# Altium project IMU Gyro+Acc only.PrjPcb
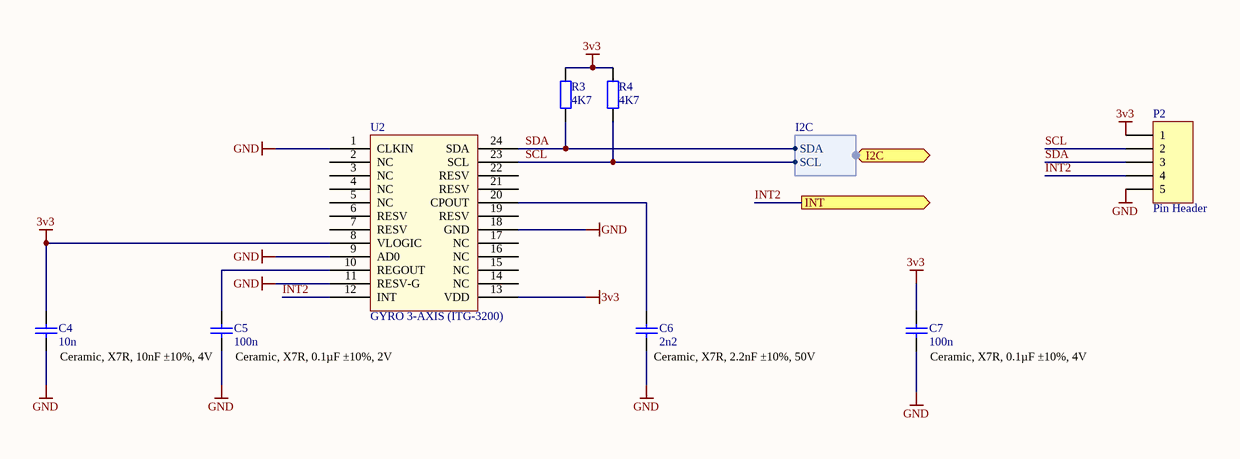
[diagram p0: GYRO 3-AXIS - ITG-3200.SchDoc]
3 sheets, 16 parts. Net scope: hierarchical (ports join the sheet entries above them; power ports are global).
Board file: Gyro+Accelero.PcbDoc
Sheets:
  GYRO 3-AXIS - ITG-3200.SchDoc
  Accelerometer 3-AXIS - BMA180.SchDoc
  Regulator 3v3-250mA MCP1702.SchDoc

## Sheet GYRO 3-AXIS - ITG-3200.SchDoc: Gyroscope, 3-Axis - I2C
size A4; Organization: Altium Limited; Address1: 3 Minna Close; Address2: Belrose; Address3: NSW 2085; Address4: Australia

### Parts
C4  10n  [C0805]
C5  100n  [C0805]
C6  2n2  [C0805]
C7  100n  [C0805]
P2  Pin Header  [PH1x5_2.54]
R3  value 4K7  [R0805]  (hidden comment: RESISTOR)
R4  value 4K7  [R0805]  (hidden comment: RESISTOR)
U2  GYRO 3-AXIS (ITG-3200)  [QFN50P400X400-24V2M - GYRO 3axis]

### Ports
I2C (harness I2C), INT (out)

### Harnesses
I2C: SDA, SCL

### Nets
3v3: C4.2 C7.2 P2.1 R3.1 R4.1 U2.8(VLOGIC) U2.13(VDD)
GND: C4.1 C5.1 C6.1 C7.1 P2.5 U2.1(CLKIN) U2.9(AD0) U2.11(RESV-G) U2.18(GND)
INT2: P2.4 U2.12(INT) ; port INT
SCL: P2.2 R4.2 U2.23(SCL) ; port I2C.SCL
SDA: P2.3 R3.2 U2.24(SDA) ; port I2C.SDA
NetC5_2: C5.2 U2.10(REGOUT)
NetC6_2: C6.2 U2.20(CPOUT)

Not connected (* = marked no-connect by the designer): U2 2(NC) 3(NC) 4(NC) 5(NC) 6(RESV) 7(RESV) 14(NC) 15(NC) 16(NC) 17(NC) 19(RESV) 21(RESV) 22(RESV)

### Notes on the sheet
- Ceramic, X7R, 10nF ±10%, 4V
- (near C5) Ceramic, X7R, 0.1µF ±10%, 2V
- (near C6) Ceramic, X7R, 2.2nF ±10%, 50V
- (near C7) Ceramic, X7R, 0.1µF ±10%, 4V
- Disclaimer
  Any design and information, hardware or software  is provided on an "as-is" basis without warranty of any kind and any express or implied warranties, including, but not limited to, the implied warranties of merchantability and fitness for a particular purpose are disclaimed. In no event shall wnpd (or KeaDrone)be liable for any direct, indirect, incidental, special, exemplary, or consequential damages (including, but not limited to, procurement of substitute goods or services; loss of use, data, or profits; or business interruption) however caused and on any theory of liability, whether in contract, strict liability, or tort (including negligence or otherwise) arising in any way out of the use of this firmware, hardware, software or information, even if wnpd (or KeaDrone) has been advised by user of the possibility of such potential loss or damage. The user agrees to hold wnpd (or KeaDrone) harmless from and against any and all claims, losses, liabilities and expenses.
- Title
- Size:
- Date:
- A4
- Name:
- Time:
- Ing. W. Pietersz
- Revision:
- Sheet
- of
- WillyPietersz@gmail.com
- Contact:
- -
- www.wnpd.nl
- File:

### Library data of the parts
C4 = 10n: Tolerance: 0.1; LatestRevision Note: Initial Release; Part Number: 10n; Value: 10n; Package: 0805; Component Type: Standard; LatestRevision Date: 31-7-2010; Author: Willy Pietersz; ComponentLink1Description: Manufacturer; ComponentLink2Description: Datasheet
C5 C7 = 100n: Tolerance: 0.1; LatestRevision Note: Initial Release; Part Number: 100n; Value: 100n; Package: 0805; Component Type: Standard; LatestRevision Date: 31-7-2010; Author: Willy Pietersz; Supplier 2: Farnell; Supplier Part Number 2: 1759266; ComponentLink1Description: Manufacturer; ComponentLink2Description: Datasheet
C6 = 2n2: Tolerance: 0.1; LatestRevision Note: Initial Release; Part Number: 2n2; Value: 2n2; Package: 0805; Component Type: Standard; LatestRevision Date: 31-7-2010; Author: Willy Pietersz; ComponentLink1Description: Manufacturer; ComponentLink2Description: Datasheet
P2 = PH1x5: Con1x5; Part Number: PH1x5; Pitch: 2.54; LatestRevision Note: Initial Release; Type: Pin Header; Number Of Pins: 5; Component Type: Standard; LatestRevision Date: 23-11-2010; Author: Willy Pietersz; Supplier 2: Farnell
R3 R4 = 4K7: Manufacturer 1: Panasonic; Manufacturer 1 Part No: ERJT06J472V; Power: 0.25W; Tolerance: 0.05; LatestRevision Note: Initial Release; Published: 8-Jun-2000; LatestRevisionDate: 17-Jul-2002; LatestRevisionNote: Re-released for DXP Platform.; PackageReference: AXIAL-0.4; Publisher: Altium Limited; Part Number: 4K7; Type: Film; Package: 0805; Component Type: Standard; LatestRevision Date: 30-7-2010; Author: Willy Pietersz; ROHS: Y; Supplier 2: Farnell; Supplier Part Number 2: 1577368; ComponentLink1Description: Manufacturer; ComponentLink2Description: Datasheet
U2 = ITG-3200: Gyro, 3-axis; Part Number: ITG-3200; Component Type: Sensor; Supplier 1: Sparkfun; Supplier Part Number 1: ITG-3200; ComponentLink1Description: Datasheet; ComponentLink1URL: http://www.sparkfun.com/datasheets/Sensors/Gyro/PS-ITG-3200-00-01.4.pdf

## Sheet Accelerometer 3-AXIS - BMA180.SchDoc: Accelerometer, 3-Axis - SPI
size A4; Organization: Altium Limited; Address1: 3 Minna Close; Address2: Belrose; Address3: NSW 2085; Address4: Australia
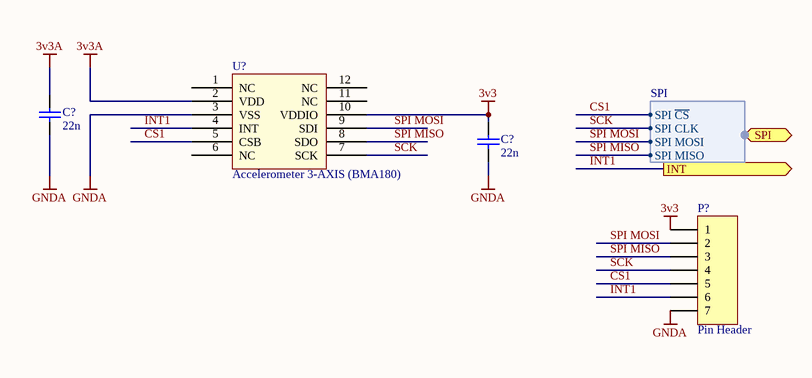
[diagram p1: Accelerometer 3-AXIS - BMA180.SchDoc]

### Parts
C12  22n  [C0805]
C15  22n  [C0805]
P?  Pin Header  [PH1x7_2.54]
U4  Accelerometer 3-AXIS (BMA180)  [BMA180]

### Ports
INT (out), SPI (harness SPI)

### Harnesses
SPI: SPI ~{CS}, SPI CLK, SPI MOSI, SPI MISO

### Nets
3v3: C12.2 P?.1 U4.10(VDDIO)
3v3A: C15.2 U4.2(VDD)
GNDA: C12.1 C15.1 P?.7 U4.3(VSS)
CS1: P?.5 U4.5(CSB) ; port SPI.SPI ~{CS}
INT1: P?.6 U4.4(INT) ; port INT
SCK: P?.4 U4.7(SCK) ; port SPI.SPI CLK
SPI MISO: P?.3 U4.8(SDO) ; port SPI.SPI MISO
SPI MOSI: P?.2 U4.9(SDI) ; port SPI.SPI MOSI

Not connected (* = marked no-connect by the designer): U4 1(NC) 6(NC) 11(NC) 12(NC)

### Notes on the sheet
- Disclaimer
  Any design and information, hardware or software  is provided on an "as-is" basis without warranty of any kind and any express or implied warranties, including, but not limited to, the implied warranties of merchantability and fitness for a particular purpose are disclaimed. In no event shall wnpd (or KeaDrone)be liable for any direct, indirect, incidental, special, exemplary, or consequential damages (including, but not limited to, procurement of substitute goods or services; loss of use, data, or profits; or business interruption) however caused and on any theory of liability, whether in contract, strict liability, or tort (including negligence or otherwise) arising in any way out of the use of this firmware, hardware, software or information, even if wnpd (or KeaDrone) has been advised by user of the possibility of such potential loss or damage. The user agrees to hold wnpd (or KeaDrone) harmless from and against any and all claims, losses, liabilities and expenses.
- Title
- Size:
- Date:
- A4
- Name:
- Time:
- Ing. W. Pietersz
- Revision:
- Sheet
- of
- WillyPietersz@gmail.com
- Contact:
- -
- www.wnpd.nl
- File:

### Library data of the parts
C12 C15 = 22n: Tolerance: 0.1; LatestRevision Note: Initial Release; Part Number: 22n; Value: 22n; Package: 0805; Component Type: Standard; LatestRevision Date: 31-7-2010; Author: Willy Pietersz; ComponentLink1Description: Manufacturer; ComponentLink2Description: Datasheet
P? = PH1x7: Con1x7; Part Number: PH1x7; Pitch: 2.54; LatestRevision Note: Initial Release; Type: Pin Header; Number Of Pins: 7; Component Type: Standard; LatestRevision Date: 23-11-2010; Author: Willy Pietersz; Supplier 2: Farnell
U4 = BMA180: Part Number: BMA180; Component Type: Sensor; Supplier 1: Digikey; Supplier Part Number 1: 828-1019-1-ND; ComponentLink1Description: Datasheet; ComponentLink1URL: http://www.bosch-sensortec.com/content/language1/downloads/BST-BMA180-FL000-03.pdf

## Sheet Regulator 3v3-250mA MCP1702.SchDoc: Regulator 3v3 out
size A4; Organization: Altium Limited; Address1: 3 Minna Close; Address2: Belrose; Address3: NSW 2085; Address4: Australia
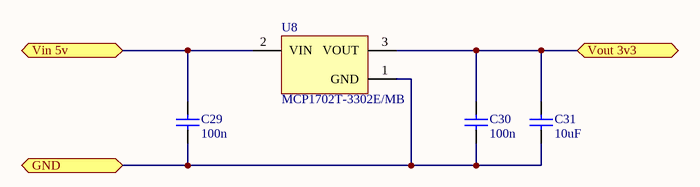
[diagram p2: Regulator 3v3-250mA MCP1702.SchDoc]

### Parts
C29  100n  [C0805]
C30  100n  [C0805]
C31  10uF  [C1206]
U8  MCP1702T-3302E/MB  [SOT-89-MB3_N]

### Ports
GND, Vin 5v, Vout 3v3

### Nets
GND: C29.1 C30.1 C31.1 U8.1(GND) ; port GND
Vin 5v: C29.2 U8.2(VIN) ; port Vin 5v
Vout 3v3: C30.2 C31.2 U8.3(VOUT) ; port Vout 3v3

### Notes on the sheet
- Disclaimer
  Any design and information, hardware or software  is provided on an "as-is" basis without warranty of any kind and any express or implied warranties, including, but not limited to, the implied warranties of merchantability and fitness for a particular purpose are disclaimed. In no event shall wnpd (or KeaDrone)be liable for any direct, indirect, incidental, special, exemplary, or consequential damages (including, but not limited to, procurement of substitute goods or services; loss of use, data, or profits; or business interruption) however caused and on any theory of liability, whether in contract, strict liability, or tort (including negligence or otherwise) arising in any way out of the use of this firmware, hardware, software or information, even if wnpd (or KeaDrone) has been advised by user of the possibility of such potential loss or damage. The user agrees to hold wnpd (or KeaDrone) harmless from and against any and all claims, losses, liabilities and expenses.
- Title
- Size:
- Date:
- A4
- Name:
- Time:
- Ing. W. Pietersz
- Revision:
- Sheet
- of
- WillyPietersz@gmail.com
- Contact:
- -
- www.wnpd.nl
- File:

### Library data of the parts
C29 C30 = 100n: as C5 on sheet GYRO 3-AXIS - ITG-3200; Part Number: 100n; Value: 100n; Package: 0805; Component Type: Standard; LatestRevision Date: 31-7-2010; Author: Willy Pietersz; Supplier 2: Farnell; Supplier Part Number 2: 1759266; ComponentLink1Description: Manufacturer; ComponentLink2Description: Datasheet
C31 = 10uF: Voltage: 10V; Type: Ceramic; Tolerance: 0.1; LatestRevision Note: Initial Release; Part Number: 10uF; Value: 10uF; Package: 1206; Component Type: Standard; LatestRevision Date: 14-9-2010; Author: Willem Pietersz; Supplier 2: Farnell; Supplier Part Number 2: 1759434; ComponentLink1Description: Manufacturer; ComponentLink2Description: Datasheet
U8 = MCP1702T-3302E/MB: Power, 250 mA Low Quiescent Current LDO Regulator, 3-Pin SOT-89, Extended Temperature, Tape and Reel; FirstPublished: 29-Jan-2009; LatestRevisionDate: 02-Dec-2009; LatestRevisionNote: Updated to datasheet revision D, Jun-2009; DatasheetVersion: revD, Jun-2009; PackageVersion: revBB, Aug-2009; PackageReference: SOT-89-MB3; Publisher: Altium Limited; PackageDescription: 3-Lead Plastic Small Outline Transistor Header (MB) [SOT-89]; Supplier 1: Digi-Key; Supplier Part Number 1: MCP1702T-3302E/MB-ND; Supplier 2: Farnell; Supplier Part Number 2: 1605558; Supplier 3: Newark; Supplier Part Number 3: 56K6993; Code_IPC: SOT89; ComponentLink1Description: Datasheet; ComponentLink1URL: http://ww1.microchip.com/downloads/en/DeviceDoc/22008d.pdf; ComponentLink2Description: Packaging Specification; ComponentLink2URL: http://www.microchip.com/stellent/groups/techpub_sg/documents/packagingspec/en012702.pdf; ComponentLink3Description: Microchip.com Home; ComponentLink3URL: http://www.microchip.com/

## Nets that join several sheets
3v3: GYRO 3-AXIS - ITG-3200 (7 pins), Accelerometer 3-AXIS - BMA180 (C12.2 P?.1 U4.10)